# Altium schematic sheet SoC18.SchDoc
size A
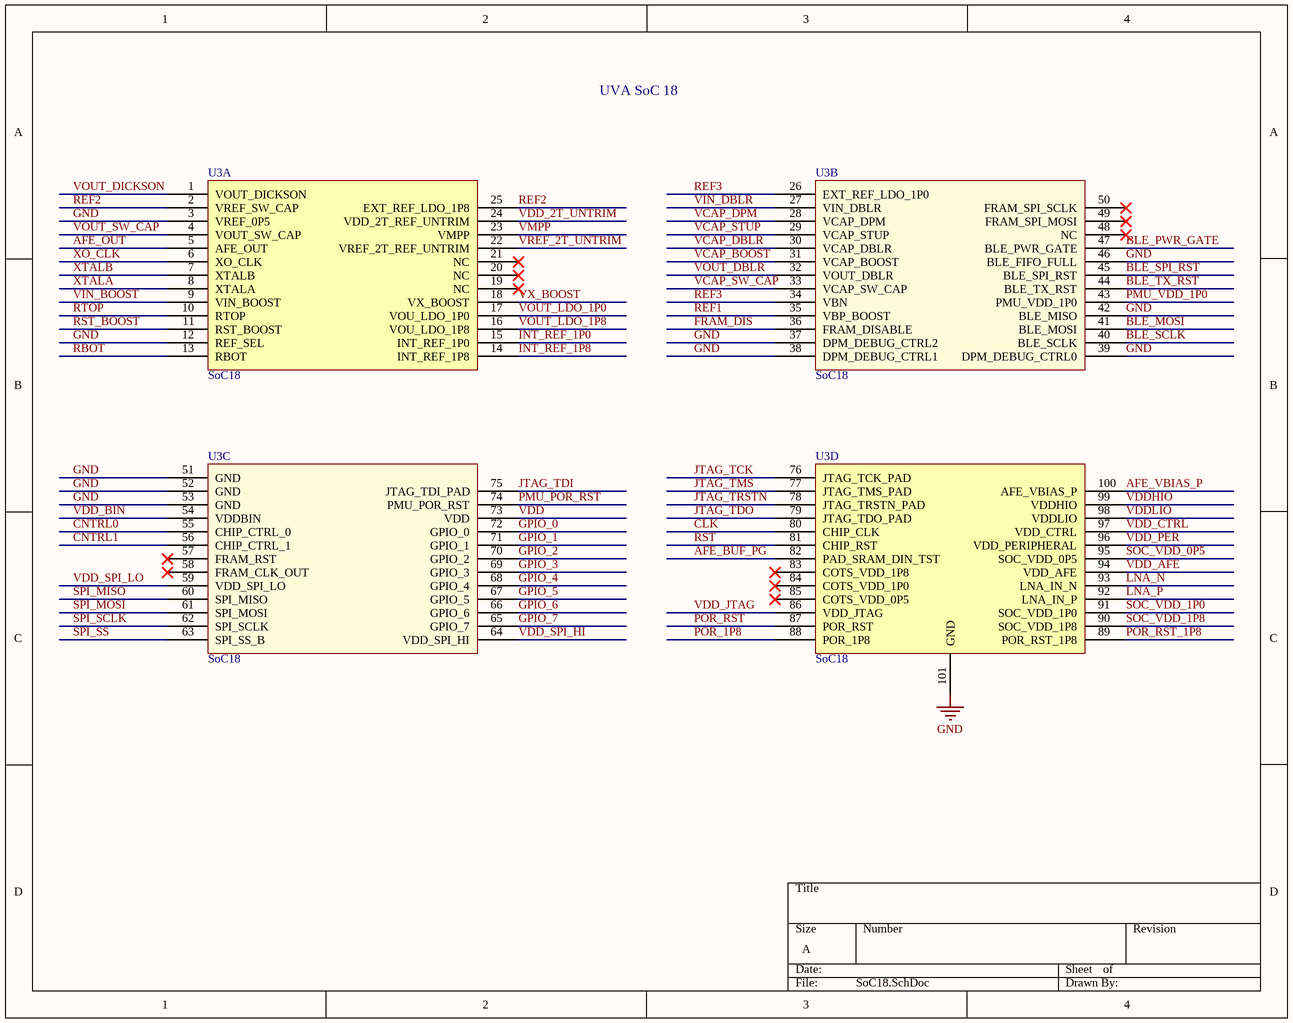
[diagram p0: SoC18.SchDoc]

## Parts
U3  SoC18  [MLF_7009 - NoHoles]  (parts A,B,C,D of 4)

## Nets
GND: U3.3(VREF_0P5) U3.12(REF_SEL) U3.37(DPM_DEBUG_CTRL2) U3.38(DPM_DEBUG_CTRL1) U3.39(DPM_DEBUG_CTRL0) U3.42(BLE_MISO) U3.46(BLE_FIFO_FULL) U3.51(GND) U3.52(GND) U3.53(GND) U3.101(GND)
AFE_BUF_PG: U3.82(PAD_SRAM_DIN_TST)
AFE_OUT: U3.5(AFE_OUT)
AFE_VBIAS_P: U3.100(AFE_VBIAS_P)
BLE_MOSI: U3.41(BLE_MOSI)
BLE_PWR_GATE: U3.47(BLE_PWR_GATE)
BLE_SCLK: U3.40(BLE_SCLK)
BLE_SPI_RST: U3.45(BLE_SPI_RST)
BLE_TX_RST: U3.44(BLE_TX_RST)
CLK: U3.80(CHIP_CLK)
CNTRL0: U3.55(CHIP_CTRL_0)
CNTRL1: U3.56(CHIP_CTRL_1)
FRAM_DIS: U3.36(FRAM_DISABLE)
GPIO_0: U3.72(GPIO_0)
GPIO_1: U3.71(GPIO_1)
GPIO_2: U3.70(GPIO_2)
GPIO_3: U3.69(GPIO_3)
GPIO_4: U3.68(GPIO_4)
GPIO_5: U3.67(GPIO_5)
GPIO_6: U3.66(GPIO_6)
GPIO_7: U3.65(GPIO_7)
INT_REF_1P0: U3.15(INT_REF_1P0)
INT_REF_1P8: U3.14(INT_REF_1P8)
JTAG_TCK: U3.76(JTAG_TCK_PAD)
JTAG_TDI: U3.75(JTAG_TDI_PAD)
JTAG_TDO: U3.79(JTAG_TDO_PAD)
JTAG_TMS: U3.77(JTAG_TMS_PAD)
JTAG_TRSTN: U3.78(JTAG_TRSTN_PAD)
LNA_N: U3.93(LNA_IN_N)
LNA_P: U3.92(LNA_IN_P)
PMU_POR_RST: U3.74(PMU_POR_RST)
PMU_VDD_1P0: U3.43(PMU_VDD_1P0)
POR_1P8: U3.88(POR_1P8)
POR_RST: U3.87(POR_RST)
POR_RST_1P8: U3.89(POR_RST_1P8)
RBOT: U3.13(RBOT)
REF1: U3.35(VBP_BOOST)
REF2: U3.2(VREF_SW_CAP) U3.25(EXT_REF_LDO_1P8)
REF3: U3.26(EXT_REF_LDO_1P0) U3.34(VBN)
RST: U3.81(CHIP_RST)
RST_BOOST: U3.11(RST_BOOST)
RTOP: U3.10(RTOP)
SOC_VDD_0P5: U3.95(SOC_VDD_0P5)
SOC_VDD_1P0: U3.91(SOC_VDD_1P0)
SOC_VDD_1P8: U3.90(SOC_VDD_1P8)
SPI_MISO: U3.60(SPI_MISO)
SPI_MOSI: U3.61(SPI_MOSI)
SPI_SCLK: U3.62(SPI_SCLK)
SPI_SS: U3.63(SPI_SS_B)
VCAP_BOOST: U3.31(VCAP_BOOST)
VCAP_DBLR: U3.30(VCAP_DBLR)
VCAP_DPM: U3.28(VCAP_DPM)
VCAP_STUP: U3.29(VCAP_STUP)
VCAP_SW_CAP: U3.33(VCAP_SW_CAP)
VDD: U3.73(VDD)
VDD_2T_UNTRIM: U3.24(VDD_2T_REF_UNTRIM)
VDD_AFE: U3.94(VDD_AFE)
VDD_BIN: U3.54(VDDBIN)
VDD_CTRL: U3.97(VDD_CTRL)
VDD_JTAG: U3.86(VDD_JTAG)
VDD_PER: U3.96(VDD_PERIPHERAL)
VDD_SPI_HI: U3.64(VDD_SPI_HI)
VDD_SPI_LO: U3.59(VDD_SPI_LO)
VDDHIO: U3.99(VDDHIO)
VDDLIO: U3.98(VDDLIO)
VIN_BOOST: U3.9(VIN_BOOST)
VIN_DBLR: U3.27(VIN_DBLR)
VMPP: U3.23(VMPP)
VOUT_DBLR: U3.32(VOUT_DBLR)
VOUT_DICKSON: U3.1(VOUT_DICKSON)
VOUT_LDO_1P0: U3.17(VOU_LDO_1P0)
VOUT_LDO_1P8: U3.16(VOU_LDO_1P8)
VOUT_SW_CAP: U3.4(VOUT_SW_CAP)
VREF_2T_UNTRIM: U3.22(VREF_2T_REF_UNTRIM)
VX_BOOST: U3.18(VX_BOOST)
XO_CLK: U3.6(XO_CLK)
XTALA: U3.8(XTALA)
XTALB: U3.7(XTALB)

Not connected (* = marked no-connect by the designer): U3 19(NC)* 20(NC)* 21(NC)* 48(NC)* 49(FRAM_SPI_MOSI)* 50(FRAM_SPI_SCLK)* 57(FRAM_RST)* 58(FRAM_CLK_OUT)* 83(COTS_VDD_1P8)* 84(COTS_VDD_1P0)* 85(COTS_VDD_0P5)*

## Notes on the sheet
- UVA SoC 18

## Library data of the parts
U3 = SoC18: UVA SoC ASSIST 2018